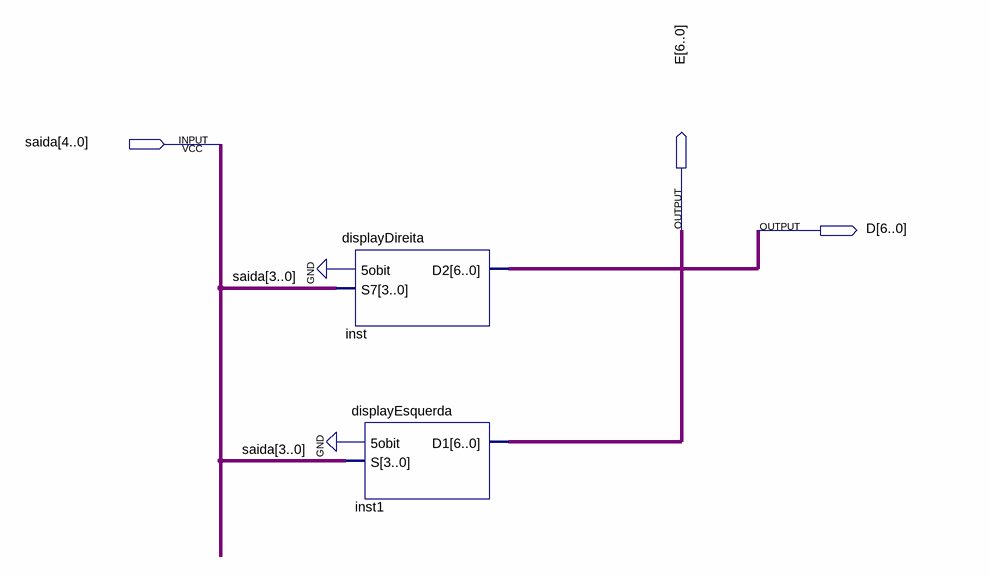
[diagram p0: schematic sheet]
// Quartus schematic displayentrada.bdf as structural Verilog: 2 symbols, 3 pins
module displayentrada (
  input  [4:0] saida,
  output [6:0] E,
  output [6:0] D
);

  displayDireita inst (.\5obit (1'b0), .S7(saida[3:0]), .D2(D));
  displayEsquerda inst1 (.\5obit (1'b0), .S(saida[3:0]), .D1(E));
endmodule
